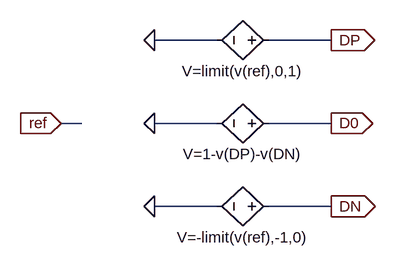
[diagram p0: schematic PN_average_modulator.asc]
PN_average_modulator.asc, the LTspice schematic file:
Version 4
SHEET 1 880 680
WIRE 304 160 208 160
WIRE 480 160 384 160
WIRE 96 288 64 288
WIRE 304 288 208 288
WIRE 480 288 384 288
WIRE 304 416 208 416
WIRE 480 416 384 416
FLAG 208 160 0
FLAG 208 288 0
FLAG 208 416 0
FLAG 480 160 DP
IOPIN 480 160 Out
FLAG 480 288 D0
IOPIN 480 288 Out
FLAG 480 416 DN
IOPIN 480 416 Out
FLAG 64 288 ref
IOPIN 64 288 In
SYMBOL bv 400 160 R90
WINDOW 0 -32 56 Invisible 2
WINDOW 3 32 56 VTop 2
SYMATTR InstName Bpos1
SYMATTR Value V=limit(v(ref),0,1)
SYMBOL bv 400 288 R90
WINDOW 0 -32 56 Invisible 2
WINDOW 3 32 56 VTop 2
SYMATTR InstName Bzero1
SYMATTR Value V=1-v(DP)-v(DN)
SYMBOL bv 400 416 R90
WINDOW 0 -32 56 Invisible 2
WINDOW 3 32 56 VTop 2
SYMATTR InstName Bneg1
SYMATTR Value V=-limit(v(ref),-1,0)

The netlist it stands for:
* PN_average_modulator.asc
Bpos1 DP 0 V=limit(v(ref),0,1)
Bzero1 D0 0 V=1-v(DP)-v(DN)
Bneg1 DN 0 V=-limit(v(ref),-1,0)
.backanno
.end